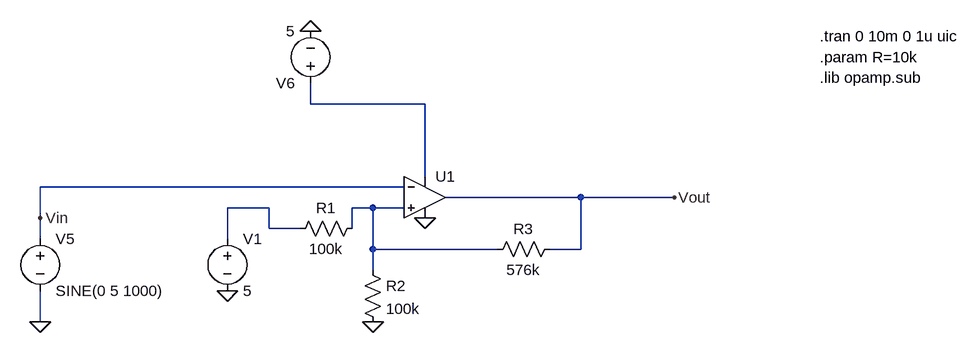
[diagram p0: schematic estudo3.asc]
estudo3.asc, the LTspice schematic file:
Version 4.1
SHEET 1 1364 708
WIRE -176 -912 -176 -944
WIRE 0 -912 -176 -912
WIRE 0 -800 0 -912
WIRE -32 -784 -592 -784
WIRE 240 -768 32 -768
WIRE 384 -768 240 -768
WIRE -240 -752 -304 -752
WIRE -80 -752 -112 -752
WIRE -32 -752 -80 -752
WIRE -592 -736 -592 -784
WIRE -240 -720 -240 -752
WIRE -192 -720 -240 -720
WIRE -112 -720 -112 -752
WIRE -592 -704 -592 -736
WIRE -304 -704 -304 -752
WIRE -80 -688 -80 -752
WIRE 112 -688 -80 -688
WIRE 240 -688 240 -768
WIRE 240 -688 192 -688
WIRE -80 -656 -80 -688
WIRE -592 -576 -592 -624
FLAG -592 -576 0
FLAG -176 -1024 0
FLAG 0 -736 0
FLAG -304 -624 0
FLAG -80 -576 0
FLAG 384 -768 Vout
FLAG -592 -736 Vin
SYMBOL OpAmps\\UniversalOpAmp2 0 -768 R0
SYMATTR InstName U1
SYMBOL voltage -592 -720 R0
WINDOW 123 0 0 Left 0
WINDOW 39 0 0 Left 0
SYMATTR InstName V5
SYMATTR Value SINE(0 5 1000)
SYMBOL voltage -176 -928 R180
WINDOW 123 0 0 Left 0
WINDOW 39 0 0 Left 0
SYMATTR InstName V6
SYMATTR Value 5
SYMBOL voltage -304 -720 R0
WINDOW 123 0 0 Left 0
WINDOW 39 0 0 Left 0
SYMATTR InstName V1
SYMATTR Value 5
SYMBOL res -96 -736 R90
WINDOW 0 0 56 VBottom 2
WINDOW 3 32 56 VTop 2
SYMATTR InstName R1
SYMATTR Value 100k
SYMBOL res -96 -672 R0
SYMATTR InstName R2
SYMATTR Value 100k
SYMBOL res 208 -704 R90
WINDOW 0 0 56 VBottom 2
WINDOW 3 32 56 VTop 2
SYMATTR InstName R3
SYMATTR Value 576k
TEXT 608 -1016 Left 2 !.tran 0 10m 0 1u uic
TEXT 608 -984 Left 2 !.param R=10k
TEXT 608 -952 Left 2 !.lib opamp.sub

The netlist it stands for:
* estudo3.asc
X§U1 N003 Vin N001 0 Vout level2 Avol=1Meg GBW=10Meg Slew=10Meg Ilimit=25m Rail=0 Vos=0 En=0 Enk=0 In=0 Ink=0 Rin=500Meg  ; pins In+ In- V+ V- OUT
V5 Vin 0 SINE(0 5 1000)
V6 N001 0 5
V1 N002 0 5
R1 N003 N002 100k
R2 N003 0 100k
R3 Vout N003 576k
.tran 0 10m 0 1u uic
.param R=10k
.lib opamp.sub
.lib UniversalOpAmp2.lib
.backanno
.end

* Results of the author's LTspice run, read from the files saved beside the schematic
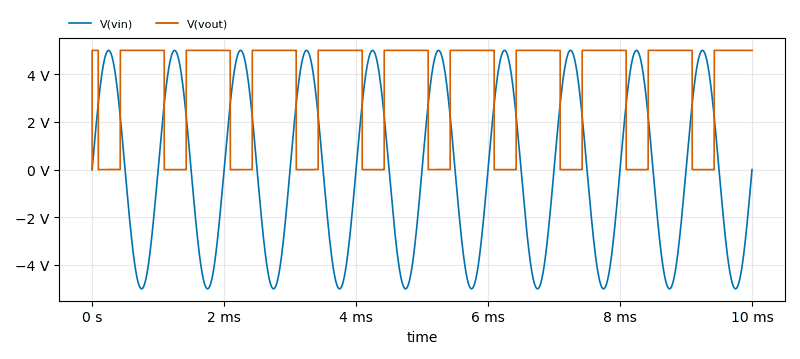
[diagram p1: Transient Analysis of estudo3.asc, plotted from the saved traces]
* Transient Analysis, 1 run:
*   V(vin): min -5 V, max 5 V, average 0 V, rms 3.536 V, last 0 V
*   V(vout): min -348.7 µV, max 5 V, average 3.334 V, rms 4.083 V, last 5 V